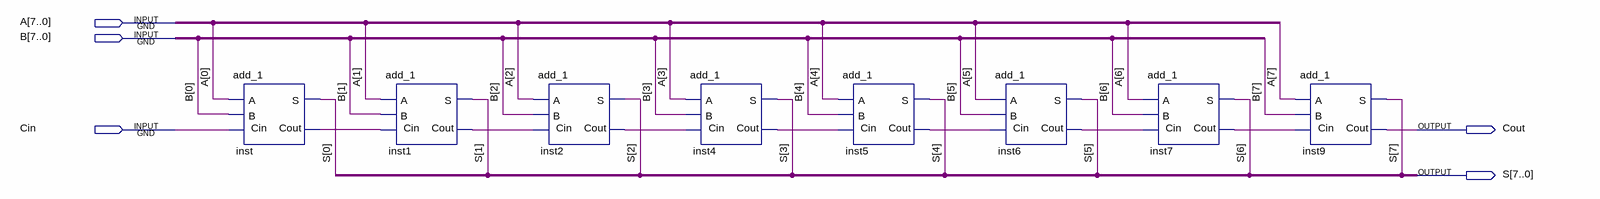
[diagram p0: schematic sheet]
// Quartus schematic add_8.bdf as structural Verilog: 8 symbols, 5 pins
module add_8 (
  input  [7:0] A,
  input  [7:0] B,
  input  Cin,
  output Cout,
  output [7:0] S
);

  wire inst1_cout, inst2_cout, inst4_cout, inst5_cout, inst6_cout, inst7_cout, inst_cout;

  add_1 inst (.A(A[0]), .B(B[0]), .Cin(Cin), .S(S[0]), .Cout(inst_cout));
  add_1 inst1 (.A(A[1]), .B(B[1]), .Cin(inst_cout), .S(S[1]), .Cout(inst1_cout));
  add_1 inst2 (.A(A[2]), .B(B[2]), .Cin(inst1_cout), .S(S[2]), .Cout(inst2_cout));
  add_1 inst4 (.A(A[3]), .B(B[3]), .Cin(inst2_cout), .S(S[3]), .Cout(inst4_cout));
  add_1 inst5 (.A(A[4]), .B(B[4]), .Cin(inst4_cout), .S(S[4]), .Cout(inst5_cout));
  add_1 inst6 (.A(A[5]), .B(B[5]), .Cin(inst5_cout), .S(S[5]), .Cout(inst6_cout));
  add_1 inst7 (.A(A[6]), .B(B[6]), .Cin(inst6_cout), .S(S[6]), .Cout(inst7_cout));
  add_1 inst9 (.A(A[7]), .B(B[7]), .Cin(inst7_cout), .S(S[7]), .Cout(Cout));
endmodule
